# EAGLE design backplane (EAGLE 6.5.0)

## Sheet 1 of 4
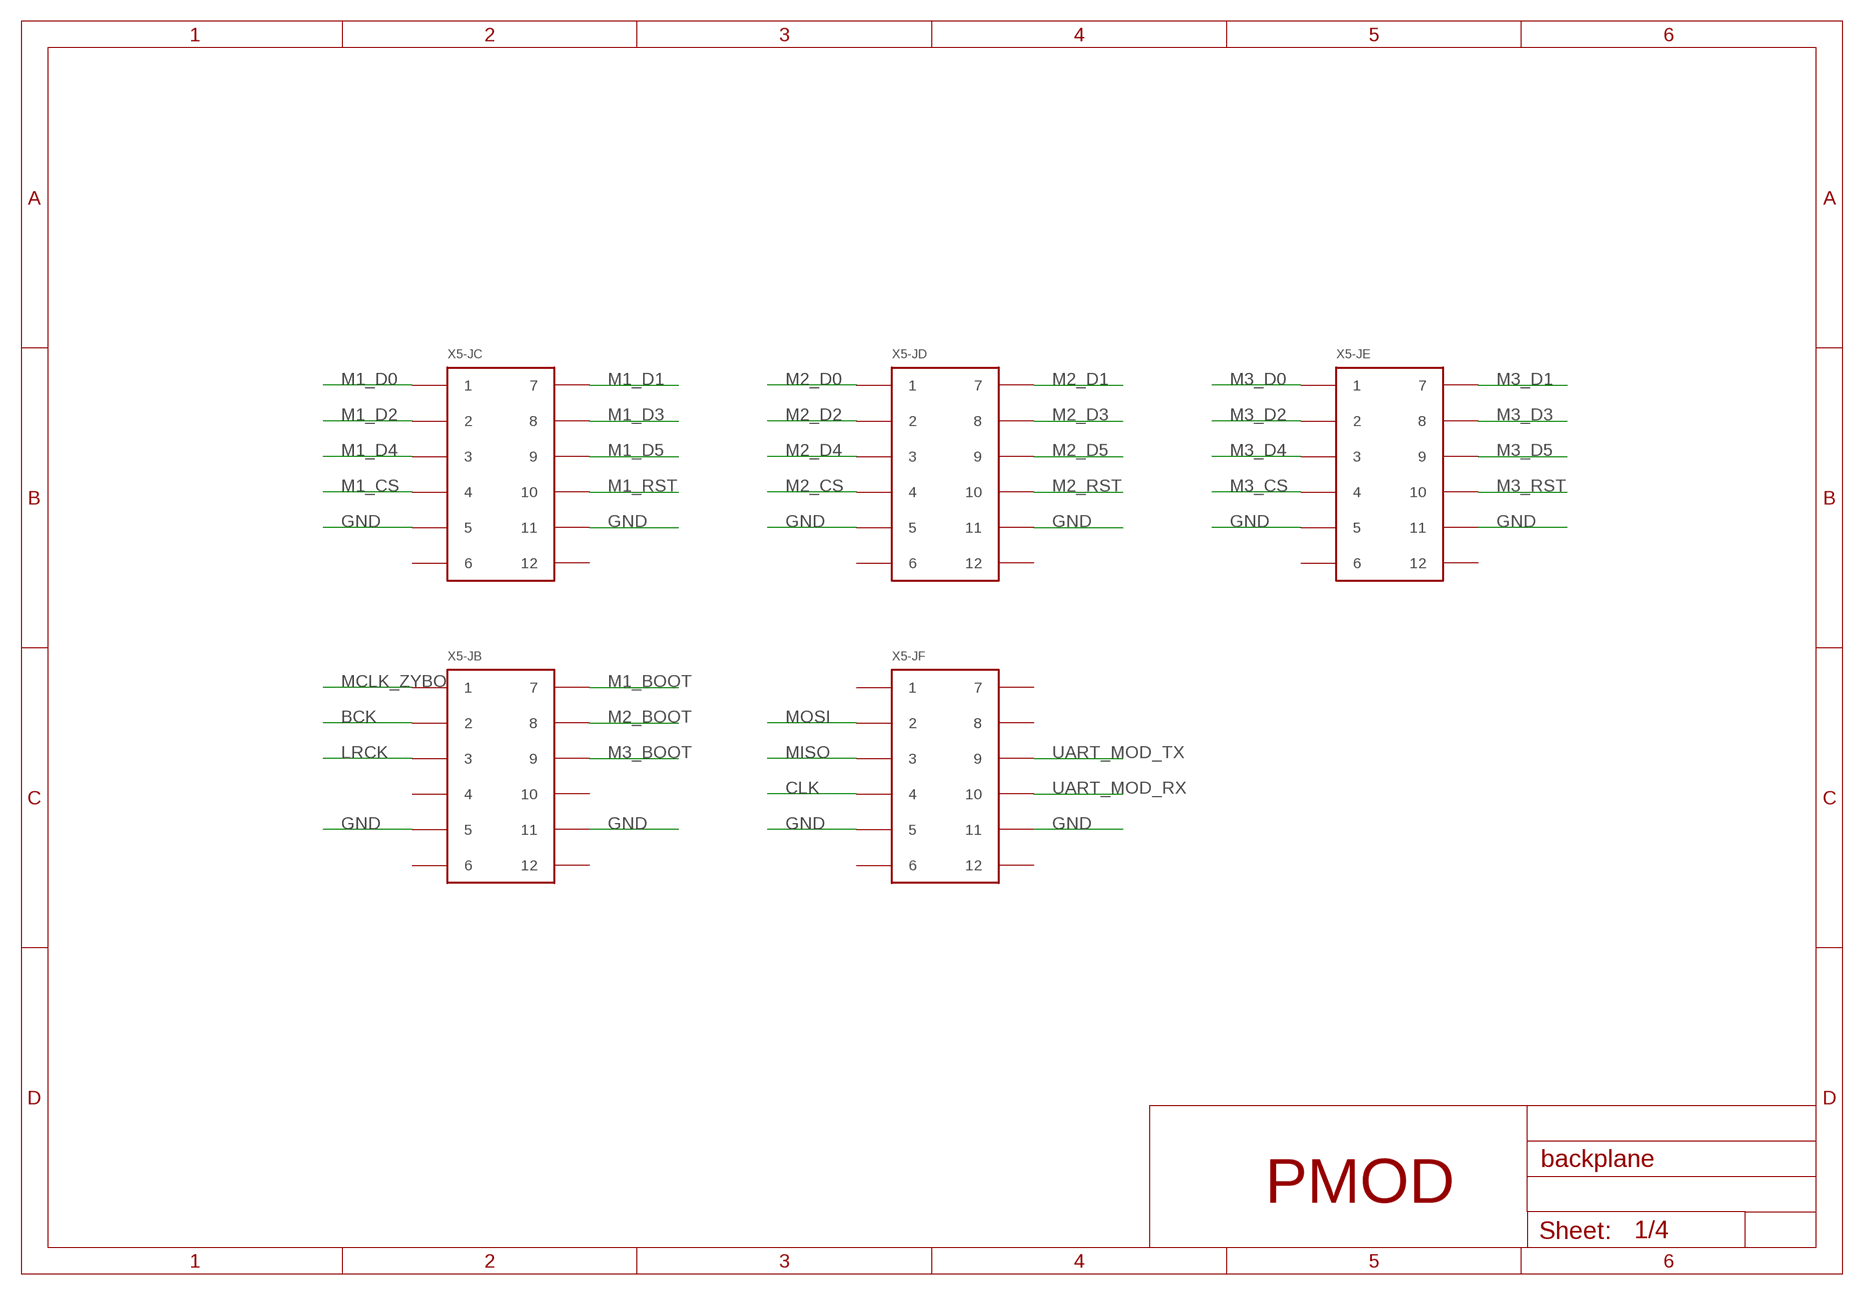
[diagram p0: schematic, sheet 1]
FRAME1 (FRAME): EXCLUDE_FROM_BOM: YES

### Parts
X5-JB  PINCON-2X6  [PINCON-2X6-SMD]
X5-JC  PINCON-2X6  [PINCON-2X6-SMD]
X5-JD  PINCON-2X6  [PINCON-2X6-SMD]
X5-JE  PINCON-2X6  [PINCON-2X6-SMD]
X5-JF  PINCON-2X6  [PINCON-2X6-SMD]

### Nets
BCK: X5-JB.P$2 ; also sheet 2
CLK: X5-JF.P$4 ; also sheet 2
GND: X5-JB.P$5 X5-JB.P$11 X5-JC.P$5 X5-JC.P$11 X5-JD.P$5 X5-JD.P$11 X5-JE.P$5 X5-JE.P$11 X5-JF.P$5 X5-JF.P$11 ; also sheet 2,3,4
LRCK: X5-JB.P$3 ; also sheet 2
M1_BOOT: X5-JB.P$7 ; also sheet 2
M1_CS: X5-JC.P$4 ; also sheet 2
M1_D0: X5-JC.P$1 ; also sheet 2
M1_D1: X5-JC.P$7 ; also sheet 2
M1_D2: X5-JC.P$2 ; also sheet 2
M1_D3: X5-JC.P$8 ; also sheet 2
M1_D4: X5-JC.P$3 ; also sheet 2
M1_D5: X5-JC.P$9 ; also sheet 2
M1_RST: X5-JC.P$10 ; also sheet 2
M2_BOOT: X5-JB.P$8 ; also sheet 2
M2_CS: X5-JD.P$4 ; also sheet 2
M2_D0: X5-JD.P$1 ; also sheet 2
M2_D1: X5-JD.P$7 ; also sheet 2
M2_D2: X5-JD.P$2 ; also sheet 2
M2_D3: X5-JD.P$8 ; also sheet 2
M2_D4: X5-JD.P$3 ; also sheet 2
M2_D5: X5-JD.P$9 ; also sheet 2
M2_RST: X5-JD.P$10 ; also sheet 2
M3_BOOT: X5-JB.P$9 ; also sheet 2
M3_CS: X5-JE.P$4 ; also sheet 2
M3_D0: X5-JE.P$1 ; also sheet 2
M3_D1: X5-JE.P$7 ; also sheet 2
M3_D2: X5-JE.P$2 ; also sheet 2
M3_D3: X5-JE.P$8 ; also sheet 2
M3_D4: X5-JE.P$3 ; also sheet 2
M3_D5: X5-JE.P$9 ; also sheet 2
M3_RST: X5-JE.P$10 ; also sheet 2
MCLK_ZYBO: X5-JB.P$1 ; also sheet 4
MISO: X5-JF.P$3 ; also sheet 2
MOSI: X5-JF.P$2 ; also sheet 2
UART_MOD_RX: X5-JF.P$10 ; also sheet 2
UART_MOD_TX: X5-JF.P$9 ; also sheet 2
Unconnected: X5-JB.P$4 X5-JB.P$6 X5-JB.P$10 X5-JB.P$12 X5-JC.P$6 X5-JC.P$12 X5-JD.P$6 X5-JD.P$12 X5-JE.P$6 X5-JE.P$12 X5-JF.P$1 X5-JF.P$6 X5-JF.P$7 X5-JF.P$8 X5-JF.P$12

### Notes on the sheet
- PMOD

## Sheet 2 of 4
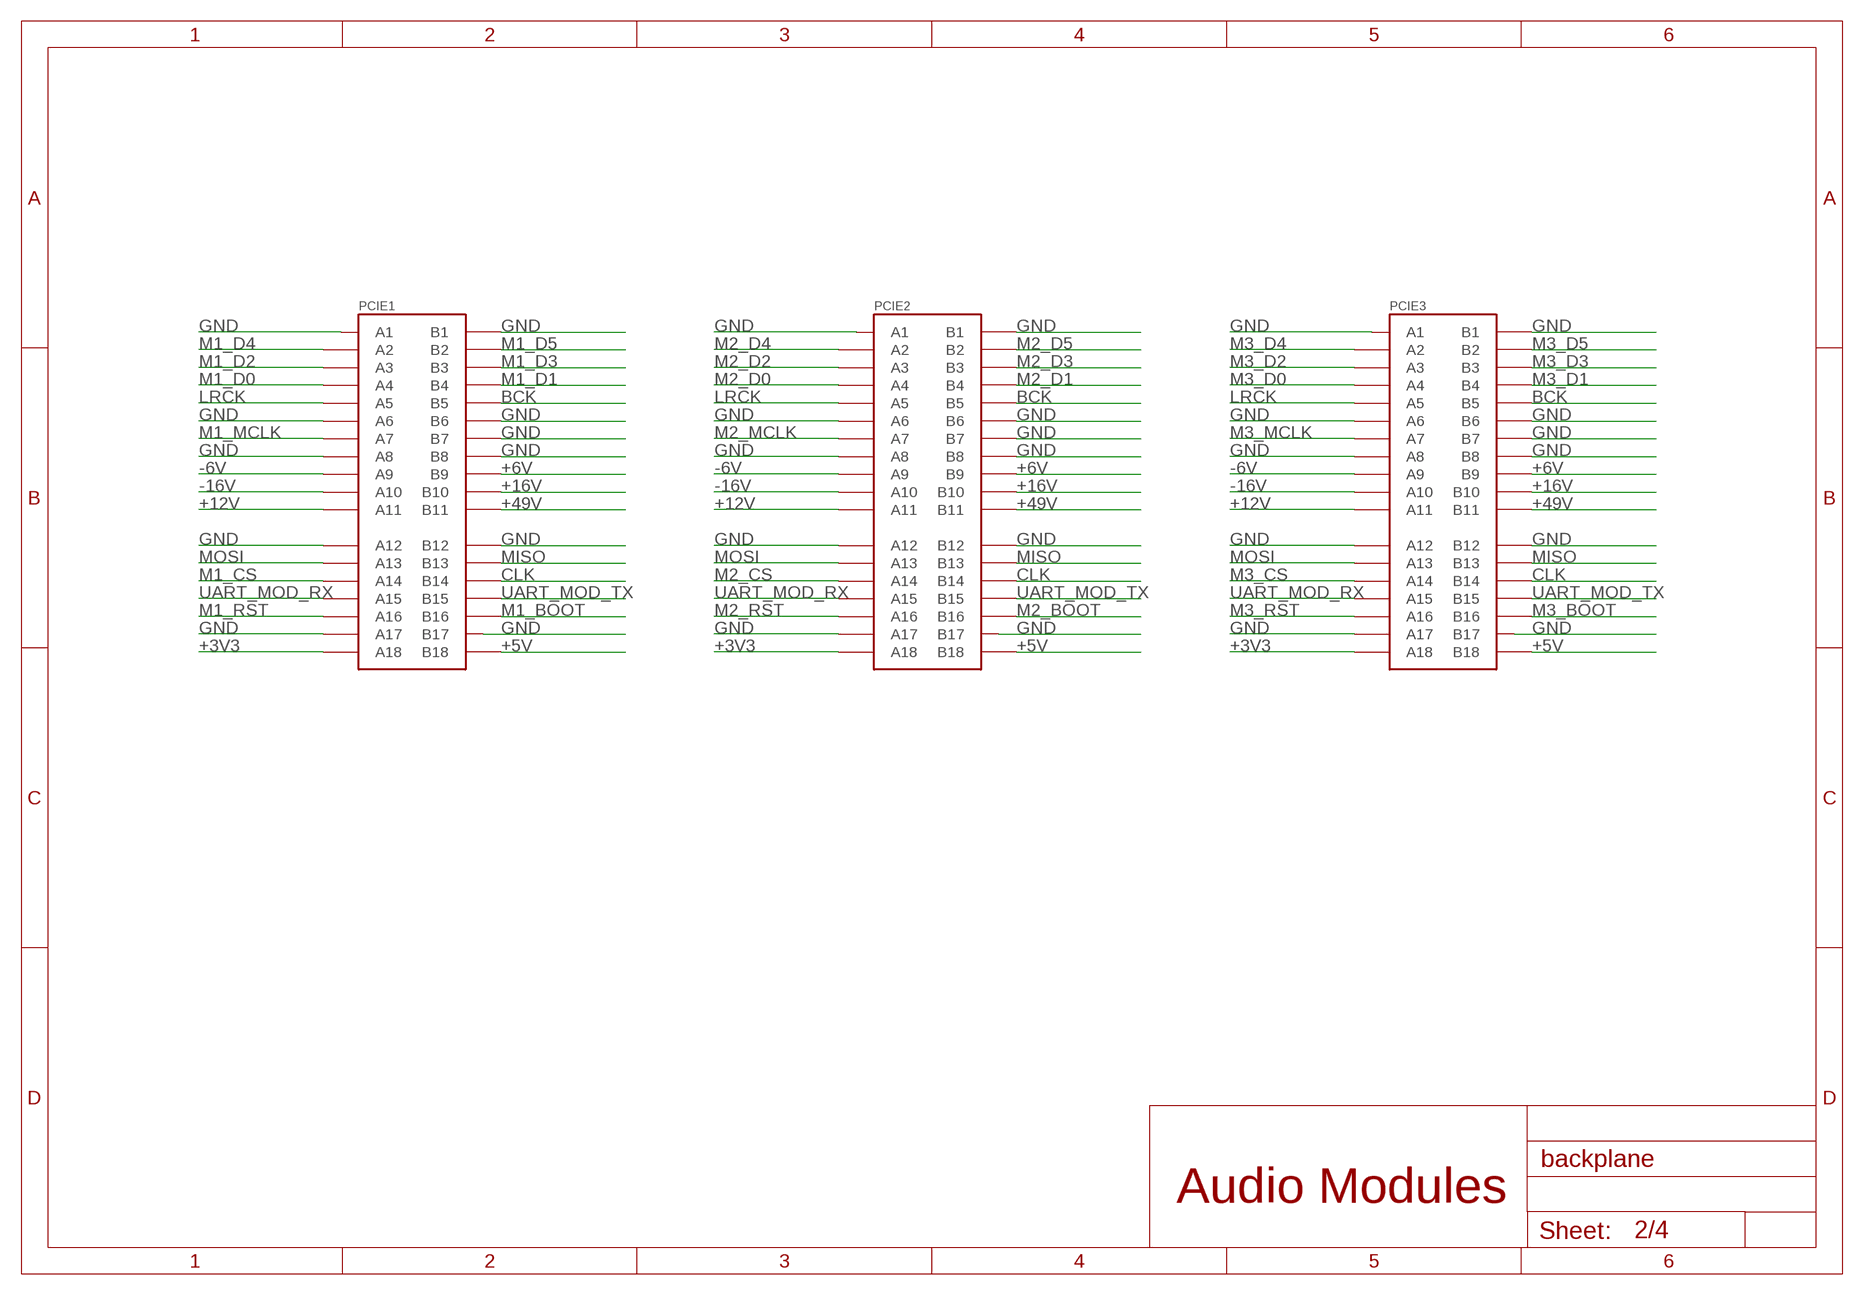
[diagram p1: schematic, sheet 2]
FRAME2 (FRAME): EXCLUDE_FROM_BOM: YES

### Parts
PCIE1  PCIE-36-SKT-SMD  [FCI-10076266-100CLF]
PCIE2  PCIE-36-SKT-SMD  [FCI-10076266-100CLF]
PCIE3  PCIE-36-SKT-SMD  [FCI-10076266-100CLF]

### Nets
+3V3: PCIE1.A18 PCIE2.A18 PCIE3.A18 ; also sheet 3,4
+5V: PCIE1.B19(B18) PCIE2.B19(B18) PCIE3.B19(B18) ; also sheet 3
+6V: PCIE1.B9 PCIE2.B9 PCIE3.B9 ; also sheet 3
+12V: PCIE1.A11 PCIE2.A11 PCIE3.A11 ; also sheet 3
+16V: PCIE1.B10 PCIE2.B10 PCIE3.B10 ; also sheet 3
+49V: PCIE1.B11 PCIE2.B11 PCIE3.B11 ; also sheet 3
-6V: PCIE1.A9 PCIE2.A9 PCIE3.A9 ; also sheet 3
-16V: PCIE1.A10 PCIE2.A10 PCIE3.A10 ; also sheet 3
BCK: PCIE1.B5 PCIE2.B5 PCIE3.B5 ; also sheet 1
CLK: PCIE1.B14 PCIE2.B14 PCIE3.B14 ; also sheet 1
GND: PCIE1.A1 PCIE1.A6 PCIE1.A8 PCIE1.A12 PCIE1.A17 PCIE1.B1 PCIE1.B6 PCIE1.B7 PCIE1.B8 PCIE1.B12 PCIE1.B18(B17) PCIE2.A1 PCIE2.A6 PCIE2.A8 PCIE2.A12 PCIE2.A17 PCIE2.B1 PCIE2.B6 PCIE2.B7 PCIE2.B8 PCIE2.B12 PCIE2.B18(B17) PCIE3.A1 PCIE3.A6 PCIE3.A8 PCIE3.A12 PCIE3.A17 PCIE3.B1 PCIE3.B6 PCIE3.B7 PCIE3.B8 PCIE3.B12 PCIE3.B18(B17) ; also sheet 1,3,4
LRCK: PCIE1.A5 PCIE2.A5 PCIE3.A5 ; also sheet 1
M1_BOOT: PCIE1.B16 ; also sheet 1
M1_CS: PCIE1.A14 ; also sheet 1
M1_D0: PCIE1.A4 ; also sheet 1
M1_D1: PCIE1.B4 ; also sheet 1
M1_D2: PCIE1.A3 ; also sheet 1
M1_D3: PCIE1.B3 ; also sheet 1
M1_D4: PCIE1.A2 ; also sheet 1
M1_D5: PCIE1.B2 ; also sheet 1
M1_MCLK: PCIE1.A7 ; also sheet 4
M1_RST: PCIE1.A16 ; also sheet 1
M2_BOOT: PCIE2.B16 ; also sheet 1
M2_CS: PCIE2.A14 ; also sheet 1
M2_D0: PCIE2.A4 ; also sheet 1
M2_D1: PCIE2.B4 ; also sheet 1
M2_D2: PCIE2.A3 ; also sheet 1
M2_D3: PCIE2.B3 ; also sheet 1
M2_D4: PCIE2.A2 ; also sheet 1
M2_D5: PCIE2.B2 ; also sheet 1
M2_MCLK: PCIE2.A7 ; also sheet 4
M2_RST: PCIE2.A16 ; also sheet 1
M3_BOOT: PCIE3.B16 ; also sheet 1
M3_CS: PCIE3.A14 ; also sheet 1
M3_D0: PCIE3.A4 ; also sheet 1
M3_D1: PCIE3.B4 ; also sheet 1
M3_D2: PCIE3.A3 ; also sheet 1
M3_D3: PCIE3.B3 ; also sheet 1
M3_D4: PCIE3.A2 ; also sheet 1
M3_D5: PCIE3.B2 ; also sheet 1
M3_MCLK: PCIE3.A7 ; also sheet 4
M3_RST: PCIE3.A16 ; also sheet 1
MISO: PCIE1.B13 PCIE2.B13 PCIE3.B13 ; also sheet 1
MOSI: PCIE1.A13 PCIE2.A13 PCIE3.A13 ; also sheet 1
UART_MOD_RX: PCIE1.A15 PCIE2.A15 PCIE3.A15 ; also sheet 1
UART_MOD_TX: PCIE1.B15 PCIE2.B15 PCIE3.B15 ; also sheet 1

### Notes on the sheet
- Audio Modules

## Sheet 3 of 4
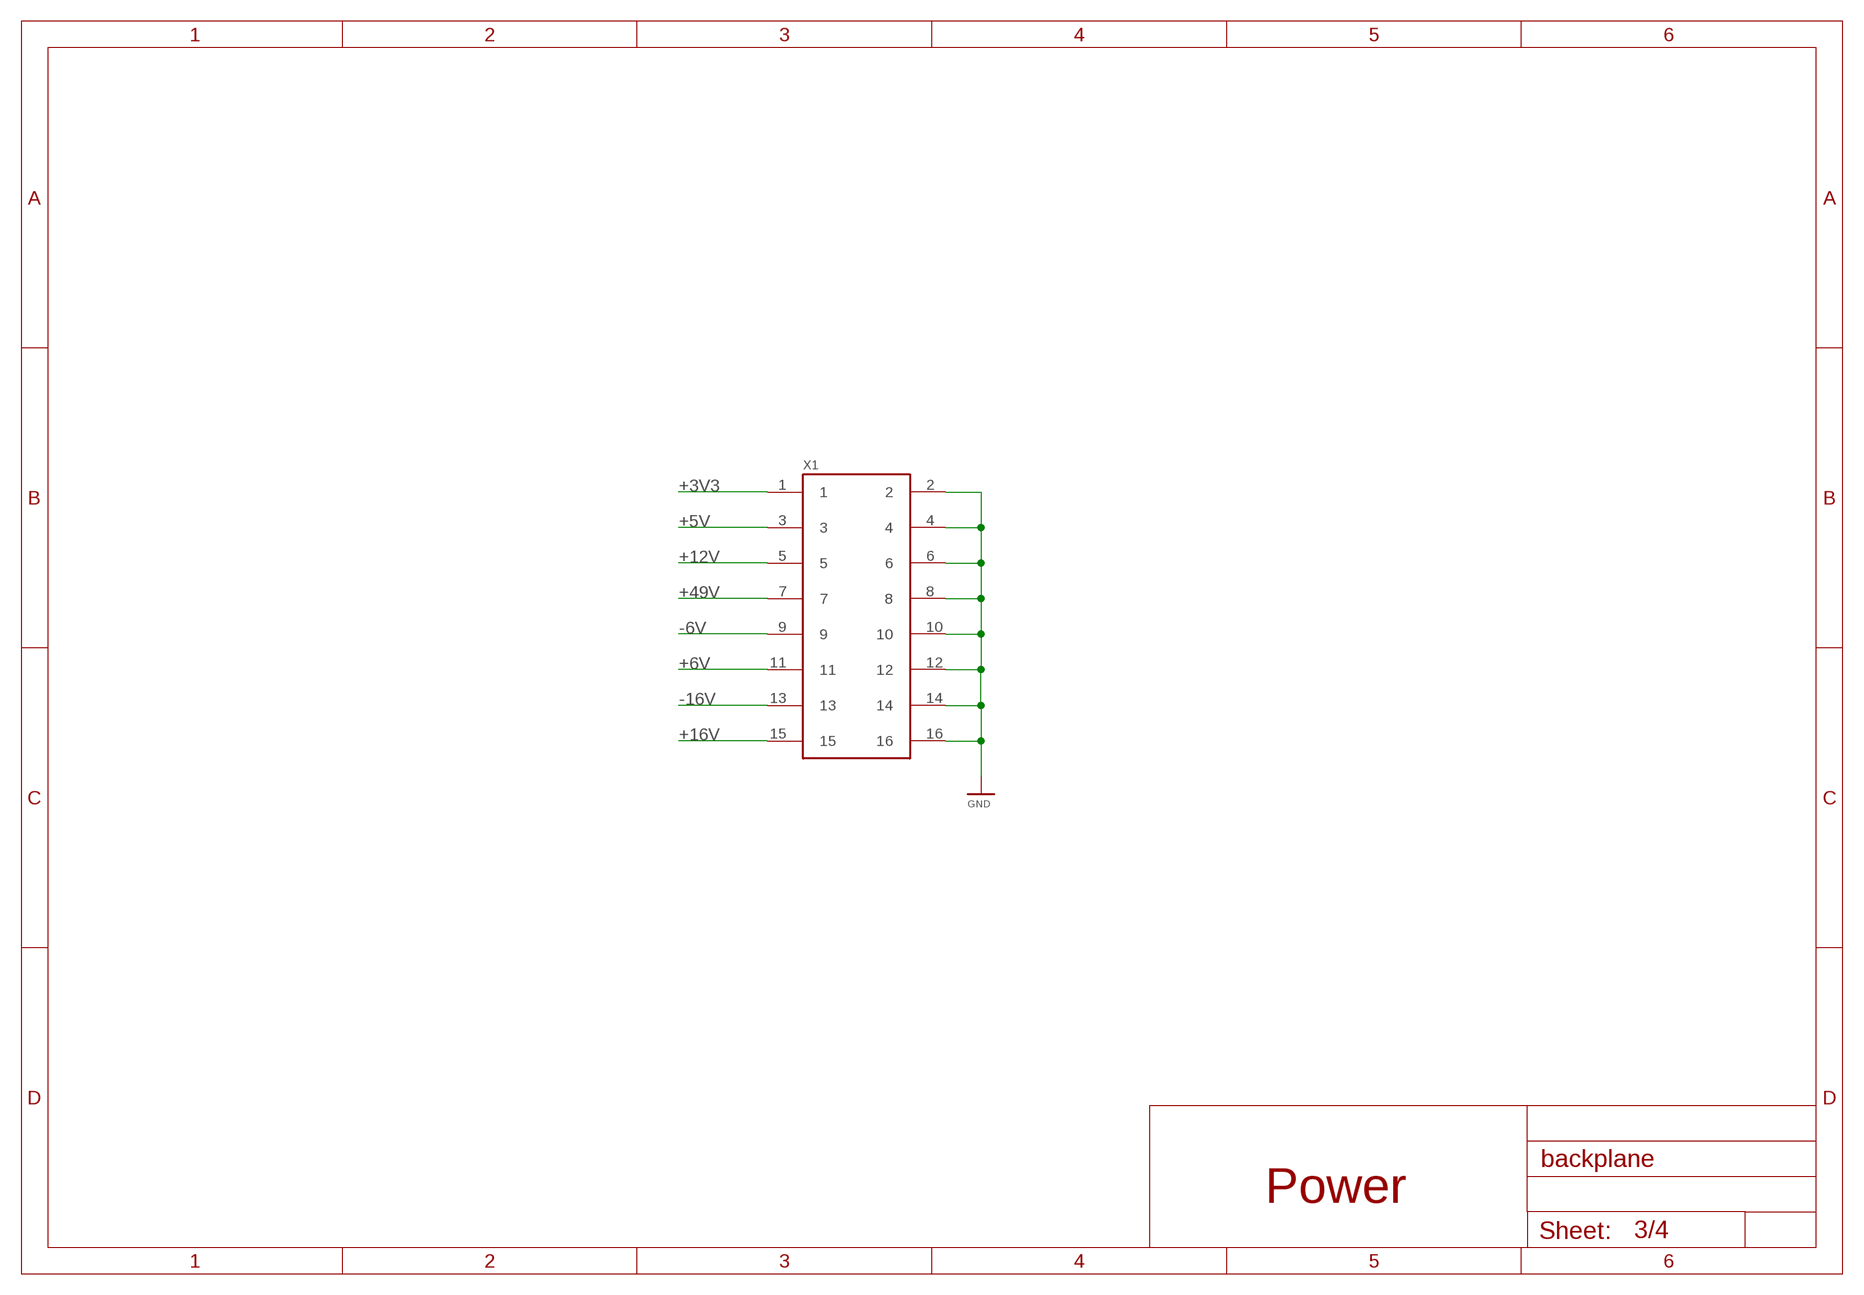
[diagram p2: schematic, sheet 3]
FRAME3 (FRAME): EXCLUDE_FROM_BOM: YES

### Parts
X1  PINCON-2X8  [PINCON-2X8]

### Nets
+3V3: X1.1 ; also sheet 2,4
+5V: X1.3 ; also sheet 2
+6V: X1.11 ; also sheet 2
+12V: X1.5 ; also sheet 2
+16V: X1.15 ; also sheet 2
+49V: X1.7 ; also sheet 2
-6V: X1.9 ; also sheet 2
-16V: X1.13 ; also sheet 2
GND: X1.2 X1.4 X1.6 X1.8 X1.10 X1.12 X1.14 X1.16 ; also sheet 1,2,4

### Notes on the sheet
- Power

## Sheet 4 of 4
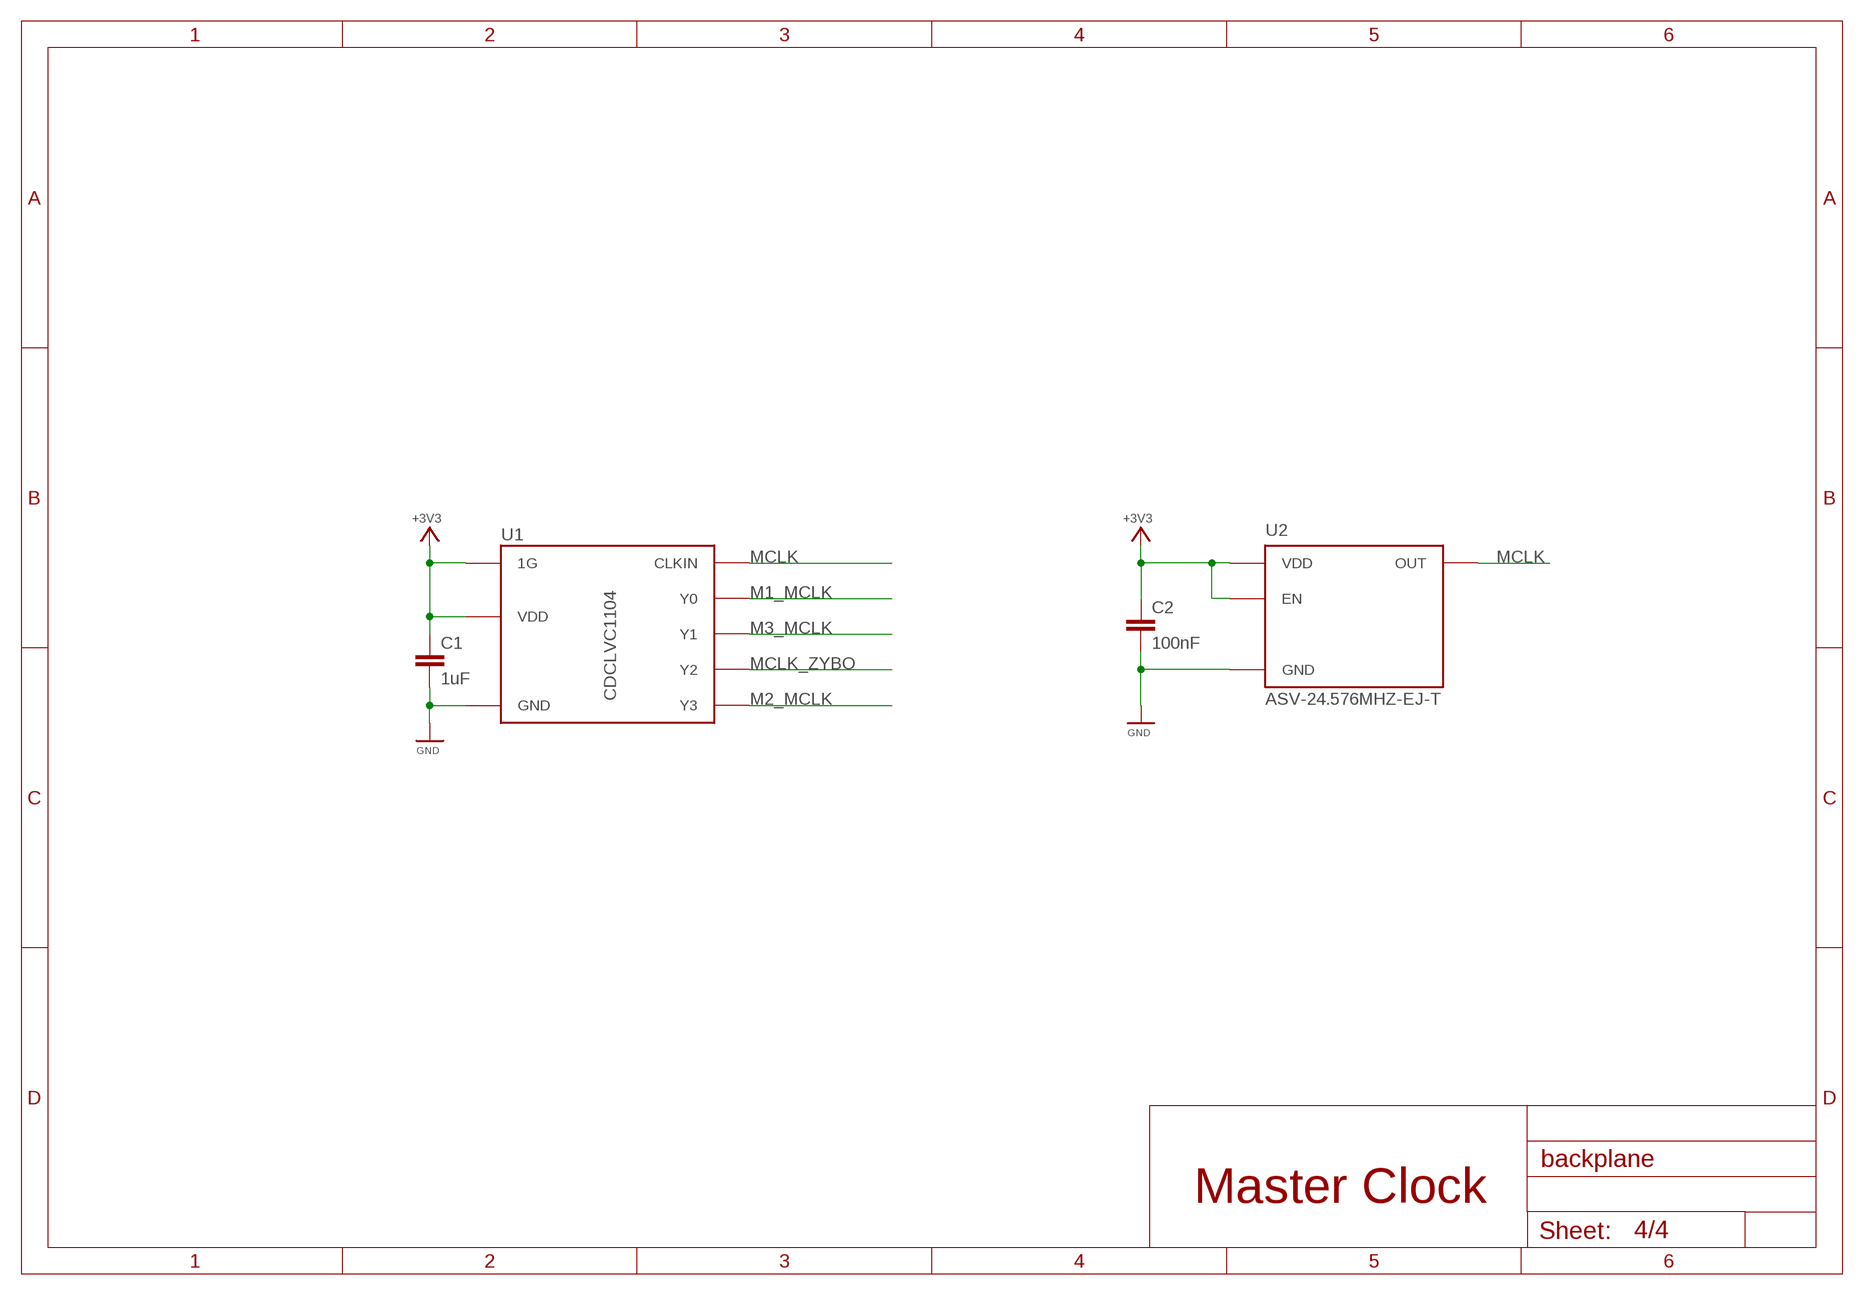
[diagram p3: schematic, sheet 4]
FRAME4 (FRAME): EXCLUDE_FROM_BOM: YES

### Parts
C1  1uF  C0805  [C0805]
C2  100nF  C0603  [C0603]
U1  CDCLVC1104  [TSSOP8]
U2  ASV-24.576MHZ-EJ-T  ABRACON_ASV  [ABRACON_ASV]

### Nets
+3V3: C1.1 C2.1 U1.2(1G) U1.6(VDD) U2.1(EN) U2.4(VDD) ; also sheet 2,3
GND: C1.2 C2.2 U1.4(GND) U2.2(GND) ; also sheet 1,2,3
M1_MCLK: U1.3(Y0) ; also sheet 2
M2_MCLK: U1.7(Y3) ; also sheet 2
M3_MCLK: U1.8(Y1) ; also sheet 2
MCLK: U1.1(CLKIN) U2.3(OUT)
MCLK_ZYBO: U1.5(Y2) ; also sheet 1

### Notes on the sheet
- Master Clock

## Library data of the parts
C1 C2 = plr_rcl:C
PCIE1-PCIE3 = plc_con:PCIE-36-*: PCI-E 36-way connectors; MANUFACTURER: FCI; MPN: 10061913-100CLF; OC_DIGIKEY: 609-2882-ND; OC_MOUSER: 649-10061913-100CLF
U1 = plr_ic:CDCLVC1104; MANUFACTURER: TI; MPN: CDCLVC1104PW; OC_DIGIKEY: 296-27549-1-ND; OC_FARNELL: 1829681; OC_MOUSER: 595-CDCLVC1104PW
U2 = plr_crystal:ABRACON_ASV; MANUFACTURER: ABRACON; MPN: ASV-24.576MHZ-EJ-T; OC_DIGIKEY: 535-9318-1-ND; OC_FARNELL: 1611834; OC_MOUSER: 815-ASV-24.576-EJ-T
X1 = plc_con:PINCON-2X8
X5-JB X5-JC X5-JD X5-JE X5-JF = plc_con:PINCON-2X6

## Board
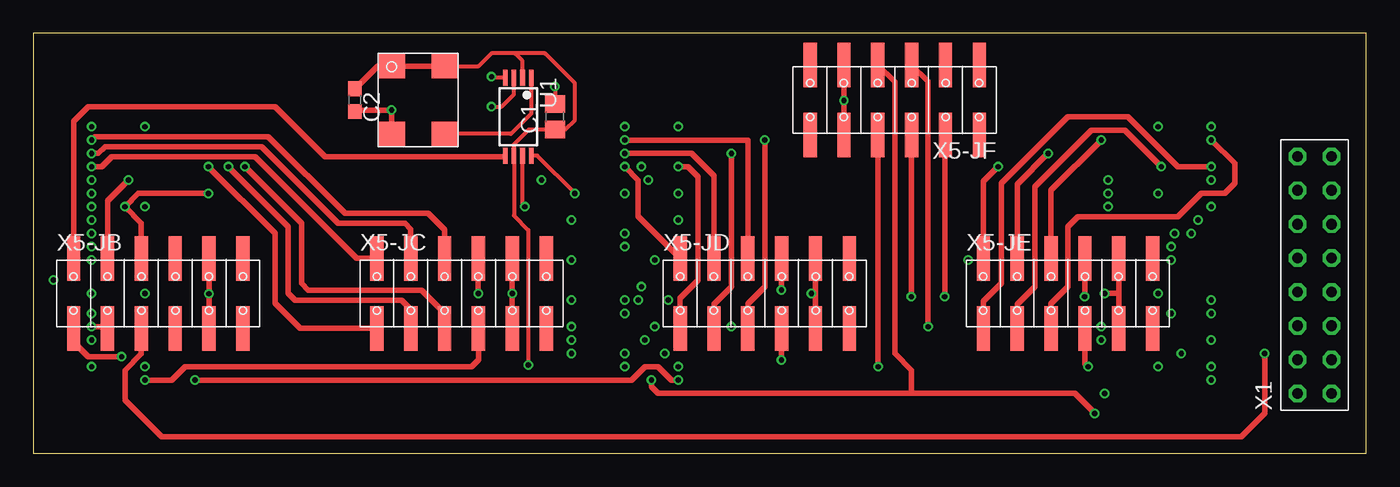
[diagram p4: board, top side]
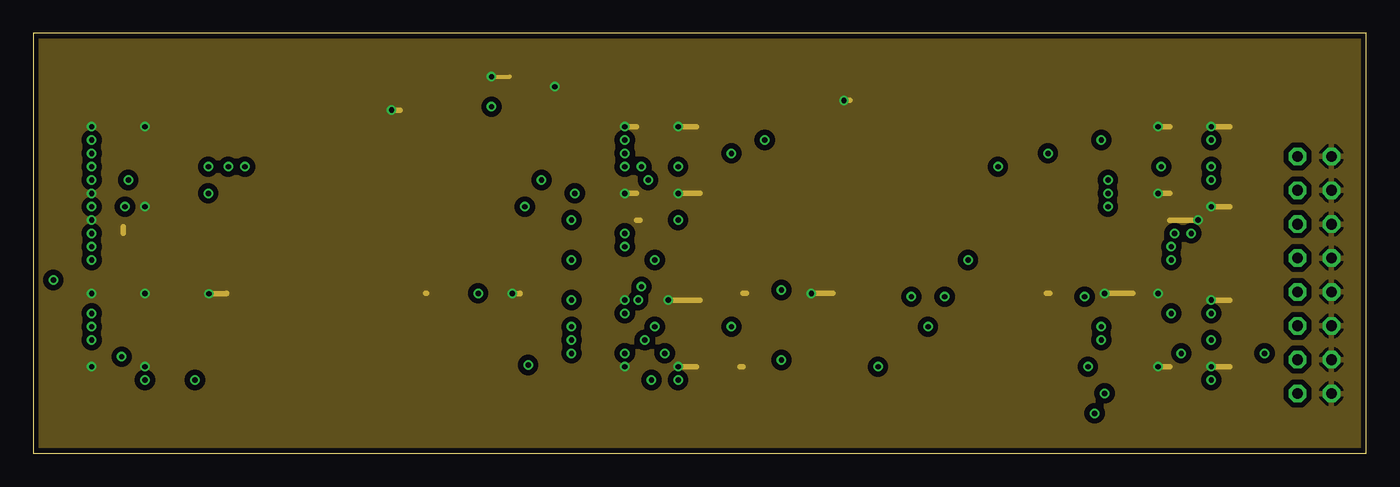
[diagram p5: board, inner layer GND]
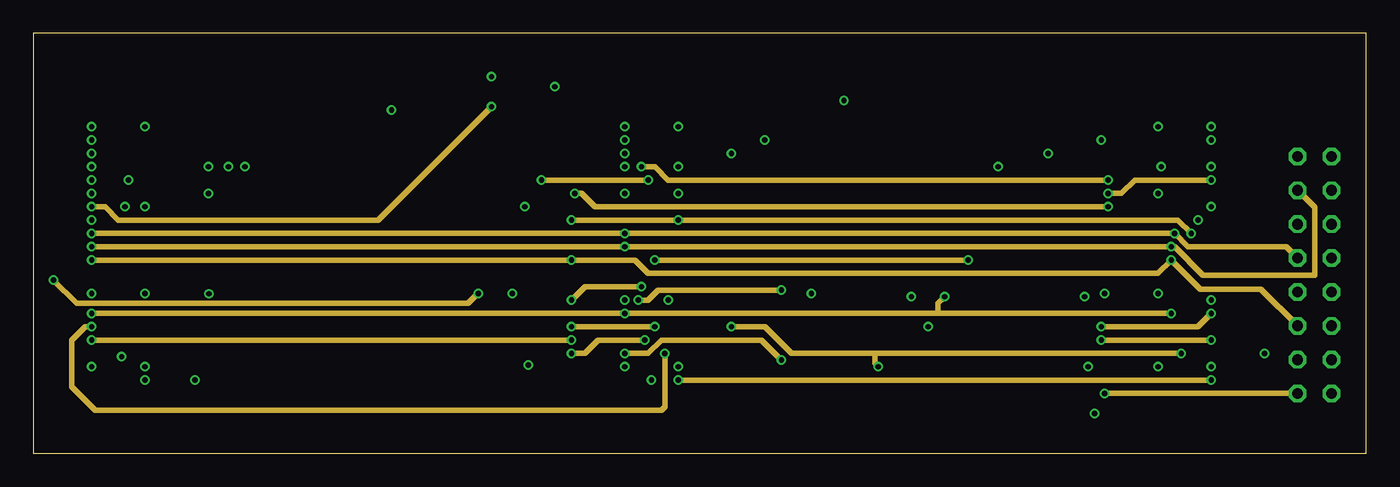
[diagram p6: board, inner layer Route15]
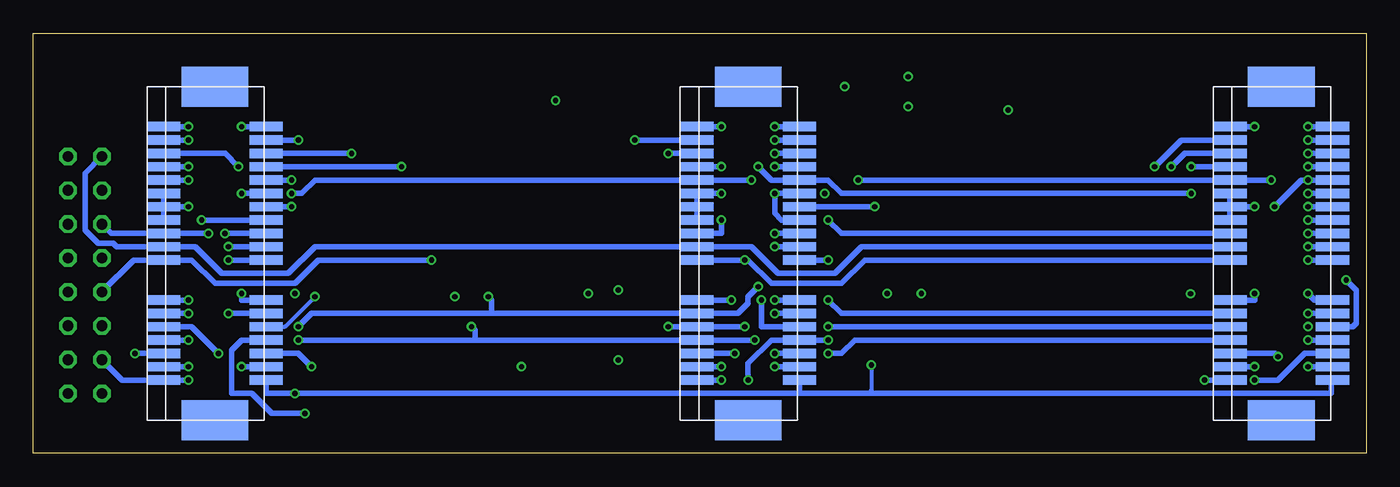
[diagram p7: board, bottom side, seen from below]

Size 100 x 31.5 mm. Coordinates in mm from the lower left corner, seen from the top.
Outline: 0,0 100,0 100,31.5 0,31.5 0,0
Copper layers ((1*2)+(15*16)): Top 0.035mm / dielectric 0.2mm / GND 0.035mm / dielectric 1mm / Route15 0.035mm / dielectric 0.2mm / Bottom 0.035mm
Design rules "Fusion_eagle_rule_v1.1 *": minimum track width 6mil, minimum drill 12mil, track to track 6mil, track to pad 6mil, pad to pad 6mil, via to via 6mil, smd to smd 0mil, copper to edge 10mil, drill to drill 10mil, minimum pad ring 10mil, minimum via ring 6mil, stop-mask expansion 2mil, vias tented up to drill 100mil, thermal gap 10mil

### Footprints (pad centres in the part's own frame; a part is rotated, then mirrored left to right if it is on the bottom)
C0805 = smd 1.3 x 1.5: 1 -0.95,0; 2 0.95,0
C0603 = smd 1.1 x 1: 1 -0.85,0; 2 0.85,0
FCI-10076266-100CLF = smd 0.7 x 2.5: A1 -9.5,3.85; A2 -8.5,3.85; A3 -7.5,3.85; A4 -6.5,3.85; A5 -5.5,3.85; A6 -4.5,3.85; A7 -3.5,3.85; A8 -2.5,3.85; A9 -1.5,3.85; A10 -0.5,3.85; A11 0.5,3.85; A12 3.5,3.85; A13 4.5,3.85; A14 5.5,3.85; A15 6.5,3.85; A16 7.5,3.85; A17 8.5,3.85; A18 9.5,3.85; B1 -9.5,-3.85; B2 -8.5,-3.85; B3 -7.5,-3.85; B4 -6.5,-3.85; B5 -5.5,-3.85; B6 -4.5,-3.85; B7 -3.5,-3.85; B8 -2.5,-3.85; B9 -1.5,-3.85; B10 -0.5,-3.85; B11 0.5,-3.85; B12 3.5,-3.85; B13 4.5,-3.85; B14 5.5,-3.85; B15 6.5,-3.85; B16 7.5,-3.85; B18 8.5,-3.85; B19 9.5,-3.85 | smd 3 x 5: P$37 -12.5,0; P$38 12.5,0
TSSOP8 = smd 1.2 x 0.35: 1 -2.925,0.975; 2 -2.925,0.325; 3 -2.925,-0.325; 4 -2.925,-0.975; 5 2.925,-0.975; 6 2.925,-0.325; 7 2.925,0.325; 8 2.925,0.975
ABRACON_ASV = smd 1.8 x 2: 1 -2.54,-2; 2 2.54,-2; 3 2.54,2; 4 -2.54,2
PINCON-2X8 = drill 0.8 octagon: 1 -8.89,1.27; 2 -8.89,-1.27; 3 -6.35,1.27; 4 -6.35,-1.27; 5 -3.81,1.27; 6 -3.81,-1.27; 7 -1.27,1.27; 8 -1.27,-1.27; 9 1.27,1.27; 10 1.27,-1.27; 11 3.81,1.27; 12 3.81,-1.27; 13 6.35,1.27; 14 6.35,-1.27; 15 8.89,1.27; 16 8.89,-1.27
PINCON-2X6-SMD = smd 1 x 3.35: P$1 -6.35,2.625; P$2 -3.81,2.625; P$3 -1.27,2.625; P$4 1.27,2.625; P$5 3.81,2.625; P$6 6.35,2.625; P$7 -6.35,-2.625; P$8 -3.81,-2.625; P$9 -1.27,-2.625; P$10 1.27,-2.625; P$11 3.81,-2.625; P$12 6.35,-2.625

### Placement (x,y rotation side)
C1  39.12,25.25 90 top
C2  24.12,26.5 270 top
PCIE1  6.38,15 270 bottom
PCIE2  46.38,15 270 bottom
PCIE3  86.38,15 270 bottom
U1  36.38,25.25 270 top
U2  28.88,26.5 270 top
X1  96.12,13.38 90 top
X5-JB  9.38,12 0 top
X5-JC  32.12,12 0 top
X5-JD  54.88,12 0 top
X5-JE  77.62,12 0 top
X5-JF  64.62,26.5 180 top

### Tracks (layer width: path | path; a pad name or v marks a point on that pad's centre or on a via)
+3V3  (via drill 0.4)
  Top 0.3: U2.4 33.41,29.04 34.38,30 36.12,30 | U1.2 36.7,29.43 36.12,30 | 36.12,30 38.38,30 40.62,27.75 40.62,25 39.92,24.3 C1.1 37.17,24.3 36.05,23.18 U1.6 36.05,17.82 37.12,16.75 v37.12,6.62
  Top 0.406: C2.1 25.82,29.04 U2.1 U2.4
  Route15 0.406: v80.38,4.5 94.84,4.5 X1.1
  Bottom 0.3: v37.12,6.62 37.12,4.75 37.38,4.5
  Bottom 0.406: PCIE1.A18 2.62,5.5 2.62,4.5 37.38,4.5 42.52,4.5 | PCIE2.A18 42.52,4.5 | 42.52,4.5 v80.38,4.5 82.53,4.5 PCIE3.A18
+5V  (via drill 0.4)
  Top 0.406: v12.12,5.5 44.88,5.5 45.88,6.5 46.88,6.5 47.88,5.5 v48.38,5.5
  Route15 0.406: v48.38,5.5 v88.38,5.5
  Bottom 0.406: PCIE1.B19 v12.12,5.5 | v48.38,5.5 PCIE2.B19 | v88.38,5.5 PCIE3.B19 93.33,5.5 X1.3
+6V  (via drill 0.4)
  Route15 0.406: v40.38,17.5 v48.38,17.5 85.88,17.5 v86.88,16.5
  Bottom 0.406: PCIE1.B9 39.38,16.5 v40.38,17.5 | v48.38,17.5 48.38,16.5 PCIE2.B9 | v86.88,16.5 PCIE3.B9 94.17,16.5 X1.11
+12V  (via drill 0.4)
  Route15 0.406: v4.38,14.5 v40.38,14.5 45.12,14.5 46.12,13.5 84.38,13.5 v85.38,14.5 87.56,12.31 92.11,12.31 X1.5
  Bottom 0.406: v4.38,14.5 PCIE1.A11 | v85.38,14.5 PCIE3.A11 | v40.38,14.5 PCIE2.A11
+16V
  Bottom 0.406: PCIE1.B10 37.88,15.5 39.88,13.5 44.12,13.5 46.12,15.5 PCIE2.B10 78.88,15.5 80.88,13.5 85.88,13.5 87.88,15.5 PCIE3.B10 93.75,15.5 94,15.75 95.12,15.75 96.12,16.75 96.12,21 X1.15
+49V  (via drill 0.4)
  Route15 0.406: v46.62,14.5 v70.12,14.5
  Bottom 0.406: PCIE1.B11 37.62,14.5 39.38,12.75 44.62,12.75 46.38,14.5 v46.62,14.5 PCIE2.B11 | v70.12,14.5 78.62,14.5 80.38,12.75 86.38,12.75 88.12,14.5 PCIE3.B11 92.46,14.5 X1.7
-6V  (via drill 0.4)
  Route15 0.406: v4.38,16.5 v44.38,16.5 v85.62,16.5 86.62,15.5 94,15.5 X1.9
  Bottom 0.406: PCIE1.A9 v4.38,16.5 | v44.38,16.5 PCIE2.A9 | v85.62,16.5 PCIE3.A9
-16V  (via drill 0.4)
  Route15 0.406: v4.38,15.5 v44.38,15.5 v85.38,15.5 85.62,15.5 87.75,13.38 96.12,13.38 96.12,18.45 X1.13
  Bottom 0.406: PCIE1.A10 v4.38,15.5 | v44.38,15.5 PCIE2.A10 | v85.38,15.5 PCIE3.A10
BCK  (via drill 0.4)
  Top 0.406: X5-JB.P$2 5.57,18.94 v7.12,20.5
  Route15 0.406: v38.12,20.5 v46.12,20.5 | v80.62,19.5 81.62,19.5 82.62,20.5 v88.38,20.5
  Bottom 0.406: v7.12,20.5 PCIE1.B5 v38.12,20.5 | v46.12,20.5 PCIE2.B5 78.88,20.5 79.88,19.5 v80.62,19.5 | v88.38,20.5 PCIE3.B5
CLK  (via drill 0.4)
  Top 0.406: X5-JF.P$4 63.38,23.86 v63.38,6.5
  Route15 0.406: v40.38,9.5 v46.62,9.5 | v86.12,7.5 63.12,7.5 | 63.12,7.5 56.88,7.5 54.88,9.5 v52.38,9.5 | v63.38,6.5 63.12,6.75 63.12,7.5
  Bottom 0.406: PCIE1.B14 v40.38,9.5 | v46.62,9.5 PCIE2.B14 v52.38,9.5 | PCIE3.B14 88.12,9.5 v86.12,7.5
GND  (via drill 0.4)
  Top 0.3: 39.17,26.25 39.17,27.45 v39.12,27.5 | U1.4 34.45,28.18 v34.38,28.25
  Top 0.406: X5-JB.P$5 v13.19,11.97 X5-JB.P$11 | X5-JC.P$11 v35.94,11.98 X5-JC.P$5 | X5-JD.P$11 58.69,11.96 | 58.69,11.96 X5-JD.P$5 | 58.69,11.96 58.41,11.96 v58.38,12 | X5-JE.P$11 81.44,12.01 | 81.44,12.01 X5-JE.P$5 | 81.44,12.01 v80.38,12.01 v80.38,12 | X5-JF.P$5 v60.81,26.47 X5-JF.P$11 | C2.2 24.23,25.75 v26.88,25.75 U2.2 | C1.2 39.17,26.25
  GND 0.3: v34.38,28.25 35.75,28.25
  GND 0.406: 6.75,17 6.75,16.5 | v44.38,24.5 45.25,24.5 | v48.38,24.5 49.75,24.5 | v44.38,19.5 45.25,19.5 | 45.5,17.5 45.25,17.5 | v48.38,6.5 49.75,6.5 | 53.25,6.5 53,6.5 | 29.44,12 29.5,12 | 53.5,12 53.25,12 | 76.25,12 76,12 | v84.38,6.5 85.25,6.5 | v88.38,6.5 89.75,6.5 | v88.38,11.5 89.75,11.5 | v87.38,17.5 85.25,17.5 | v84.38,19.5 85.25,19.5 | v88.38,18.5 89.75,18.5 | v84.38,24.5 85.25,24.5 | v88.38,24.5 89.75,24.5 | v13.19,11.97 14.47,11.97 14.5,12 | v47.62,11.5 50,11.5 | v35.94,11.98 36.52,11.98 36.5,12 | v58.38,12 60,12 | v80.38,12 82.5,12 | v48.38,19.5 50,19.5 | v60.81,26.47 61.28,26.47 61.25,26.5 | v26.88,25.75 27.5,25.75
  Bottom 0.406: PCIE1.A1 v4.38,24.5 | PCIE1.B1 v8.38,24.5 | PCIE1.A6 v4.38,19.5 | PCIE1.A8 v4.38,17.5 | PCIE1.B6 PCIE1.B7 | PCIE1.B7 PCIE1.B8 | PCIE1.B7 v8.38,18.5 | PCIE1.A17 v4.38,6.5 | PCIE1.B12 8.38,11.5 v8.38,12 | PCIE2.A1 v44.38,24.5 | PCIE2.B1 v48.38,24.5 | PCIE2.A6 v44.38,19.5 44.38,18 43.88,17.5 PCIE2.A8 | PCIE2.B8 PCIE2.B7 PCIE2.B6 v48.38,19.5 | PCIE2.A12 v44.38,11.5 | PCIE2.A17 v44.38,6.5 | PCIE2.B18 v48.38,6.5 | PCIE3.A17 v84.38,6.5 | PCIE3.B18 v88.38,6.5 | PCIE3.A12 84.38,11.5 v84.38,12 | PCIE3.B12 v88.38,11.5 | PCIE3.A8 v87.38,17.5 | PCIE3.A6 v84.38,19.5 | PCIE3.B8 PCIE3.B7 | PCIE3.B7 PCIE3.B6 | PCIE3.B7 v88.38,18.5 | PCIE3.A1 v84.38,24.5 | PCIE3.B1 v88.38,24.5 | PCIE2.B12 v47.62,11.5 | PCIE1.B18 v8.38,6.5 | PCIE1.A12 3.88,11.5 v4.38,12
  pour GND (isolate 0.4): -3.5,35 105.5,35 105.5,-2.75 -3.5,-2.75
LRCK  (via drill 0.4)
  Top 0.406: X5-JB.P$3 8.11,17.27 v6.88,18.5 7.88,19.5 v13.12,19.5
  Route15 0.406: v45.62,21.5 46.62,21.5 47.62,20.5 v80.62,20.5
  Bottom 0.406: v6.88,18.5 4.88,20.5 v4.38,20.5 PCIE1.A5 | v13.12,19.5 39.38,19.5 40.38,20.5 PCIE2.A5 44.62,20.5 v45.62,21.5 | v80.62,20.5 PCIE3.A5
M1_BOOT  (via drill 0.4)
  Top 0.406: v6.62,7.25 4.12,7.25 3.02,8.35 X5-JB.P$7
  Bottom 0.406: PCIE1.B16 6.88,7.5 v6.62,7.25
M1_CS  (via drill 0.4)
  Top 0.406: v33.38,12 33.38,14.61 X5-JC.P$4
  Route15 0.406: v1.5,13 3.25,11.25 32.62,11.25 v33.38,12
  Bottom 0.406: PCIE1.A14 1,9.5 0.75,9.75 0.75,12.25 v1.5,13
M1_D0  (via drill 0.4)
  Top 0.406: X5-JC.P$1 24.25,14.62 16.62,22.25 5.88,22.25 5.12,21.5 v4.38,21.5
  Bottom 0.406: v4.38,21.5 PCIE1.A4
M1_D1  (via drill 0.4)
  Top 0.406: X5-JC.P$7 20,9.38 18.12,11.25 18.12,16.5 v13.12,21.5
  Bottom 0.406: v13.12,21.5 PCIE1.B4
M1_D2  (via drill 0.4)
  Top 0.406: X5-JC.P$2 28.32,16.81 27.88,17.25 22.88,17.25 17.12,23 5.38,23 4.88,22.5 v4.38,22.5
  Bottom 0.406: v4.38,22.5 PCIE1.A3
M1_D3  (via drill 0.4)
  Top 0.406: X5-JC.P$8 28.32,10.81 27.62,11.5 19.62,11.5 19.12,12 19.12,17 v14.62,21.5
  Bottom 0.406: v14.62,21.5 13.62,22.5 PCIE1.B3
M1_D4  (via drill 0.4)
  Top 0.406: X5-JC.P$3 30.86,16.77 29.62,18 23.38,18 17.62,23.75 4.62,23.75 v4.38,23.5
  Bottom 0.406: v4.38,23.5 PCIE1.A2
M1_D5  (via drill 0.4)
  Top 0.406: X5-JC.P$9 30.86,10.52 29.12,12.25 20.62,12.25 20.12,12.75 20.12,17.25 v15.88,21.5
  Bottom 0.406: v15.88,21.5 13.88,23.5 PCIE1.B2
M1_MCLK  (via drill 0.4)
  Top 0.3: v34.38,26 35.12,26 36.05,26.93 U1.3
  Route15 0.406: v4.38,18.5 5.38,18.5 6.38,17.5 25.88,17.5 v34.38,26
  Bottom 0.406: PCIE1.A7 v4.38,18.5
M1_RST  (via drill 0.4)
  Top 0.406: v8.38,5.5 10.38,5.5 11.38,6.5 32.88,6.5 33.4,7.02 X5-JC.P$10
  Bottom 0.406: PCIE1.A16 4.62,7.5 6.62,5.5 v8.38,5.5
M2_BOOT  (via drill 0.4)
  Top 0.406: v4.38,9.5 5.44,9.5 X5-JB.P$8
  Route15 0.406: v47.38,7.5 47.38,3.5 47.12,3.25 4.62,3.25 2.88,5 2.88,8.5 3.88,9.5 v4.38,9.5
  Bottom 0.406: PCIE2.B16 v47.38,7.5
M2_CS  (via drill 0.4)
  Top 0.406: v56.12,12.25 56.12,14.61 X5-JD.P$4
  Route15 0.406: v45.38,11.5 46.12,11.5 46.88,12.25 v56.12,12.25
  Bottom 0.406: PCIE2.A14 45.38,9.5 v45.38,11.5
M2_D0  (via drill 0.4)
  Top 0.406: X5-JD.P$1 45.38,17.77 45.38,20.5 v44.38,21.5
  Bottom 0.406: v44.38,21.5 PCIE2.A4
M2_D1  (via drill 0.4)
  Top 0.406: X5-JD.P$7 48.52,11.65 49.88,13 49.88,20.75 49.12,21.5 v48.38,21.5
  Bottom 0.406: v48.38,21.5 PCIE2.B4
M2_D2  (via drill 0.4)
  Top 0.406: X5-JD.P$2 51.06,20.81 49.38,22.5 v44.38,22.5
  Bottom 0.406: v44.38,22.5 PCIE2.A3
M2_D3  (via drill 0.4)
  Top 0.406: X5-JD.P$8 51.06,11.19 52.38,12.5 v52.38,22.5
  Bottom 0.406: v52.38,22.5 PCIE2.B3
M2_D4  (via drill 0.4)
  Top 0.406: X5-JD.P$3 53.6,23.5 v44.38,23.5
  Bottom 0.406: v44.38,23.5 PCIE2.A2
M2_D5  (via drill 0.4)
  Top 0.406: X5-JD.P$9 53.6,11.23 54.88,12.5 v54.88,23.5
  Bottom 0.406: v54.88,23.5 PCIE2.B2
M2_MCLK  (via drill 0.4)
  Top 0.3: v36.88,18.5 36.7,18.68 U1.7
  Bottom 0.406: PCIE2.A7 v36.88,18.5
M2_RST  (via drill 0.4)
  Top 0.406: v56.12,7 56.12,9.36 X5-JD.P$10
  Route15 0.406: v44.38,7.5 46.12,7.5 47.12,8.5 54.62,8.5 v56.12,7
  Bottom 0.406: PCIE2.A16 v44.38,7.5
M3_BOOT  (via drill 0.4)
  Top 0.406: X5-JB.P$9 8.11,7.48 6.88,6.25 6.88,4 9.62,1.25 90.62,1.25 92.38,3 v92.38,7.5
  Bottom 0.406: v92.38,7.5 PCIE3.B16
M3_CS  (via drill 0.4)
  Top 0.406: v78.88,11.75 78.88,14.61 X5-JE.P$4
  Bottom 0.3: PCIE3.A14 81.12,9.5 v78.88,11.75
M3_D0  (via drill 0.4)
  Top 0.406: X5-JE.P$1 71.28,20.4 v72.38,21.5
  Bottom 0.406: v72.38,21.5 PCIE3.A4
M3_D1  (via drill 0.4)
  Top 0.406: X5-JE.P$7 71.28,11.4 72.62,12.75 72.62,20.25 77.62,25.25 82.12,25.25 85.88,21.5 v88.38,21.5
  Bottom 0.406: v88.38,21.5 PCIE3.B4
M3_D2  (via drill 0.4)
  Top 0.406: X5-JE.P$2 73.81,20.19 v76.12,22.5
  Bottom 0.406: v76.12,22.5 PCIE3.A3
M3_D3  (via drill 0.4)
  Top 0.406: X5-JE.P$8 73.81,11.19 75.12,12.5 75.12,20 79.38,24.25 81.88,24.25 v84.62,21.5
  Bottom 0.406: v84.62,21.5 85.62,22.5 PCIE3.B3
M3_D4  (via drill 0.4)
  Top 0.406: X5-JE.P$3 76.36,19.73 v80.12,23.5
  Bottom 0.406: v80.12,23.5 PCIE3.A2
M3_D5  (via drill 0.4)
  Top 0.406: X5-JE.P$9 76.36,11.23 77.62,12.5 77.62,17 78.38,17.75 85.88,17.75 87.62,19.5 89.38,19.5 90.12,20.25 90.12,21.75 v88.38,23.5
  Bottom 0.406: v88.38,23.5 PCIE3.B2
M3_MCLK  (via drill 0.4)
  Top 0.3: v40.62,19.5 37.8,22.32 U1.8
  Route15 0.406: v80.62,18.5 42.12,18.5 41.12,19.5 v40.62,19.5
  Bottom 0.406: PCIE3.A7 v80.62,18.5
M3_RST  (via drill 0.4)
  Top 0.406: v79.12,6.5 78.89,6.73 X5-JE.P$10
  Bottom 0.406: PCIE3.A16 80.12,7.5 v79.12,6.5
MCLK
  Top 0.3: U1.1 37.35,25.48 35.84,23.96 U2.3
MCLK_ZYBO
  Top 0.406: X5-JB.P$1 3.02,24.9 4.12,26 18.12,26 21.88,22.25 35.33,22.25 U1.5
MISO  (via drill 0.4)
  Top 0.406: X5-JF.P$3 65.88,23.86 v65.88,11.75
  Route15 0.406: v40.38,11.5 41.38,12.5 v45.62,12.5 | v80.12,9.5 87.38,9.5 v88.38,10.5
  Bottom 0.406: PCIE1.B13 39.38,10.5 v40.38,11.5 | 65.62,10.5 PCIE2.B13 47.12,10.5 46.38,11.25 46.38,11.75 v45.62,12.5 | 65.62,10.5 79.12,10.5 v80.12,9.5 | v88.38,10.5 PCIE3.B13 | v65.88,11.75 65.62,11.5 65.62,10.5
MOSI  (via drill 0.4)
  Top 0.406: X5-JF.P$2 68.38,23.82 v68.38,11.75
  Route15 0.406: v4.38,10.5 v44.38,10.5 67.88,10.5 | 67.88,10.5 v85.38,10.5 | v68.38,11.75 67.88,11.25 67.88,10.5
  Bottom 0.406: PCIE1.A13 v4.38,10.5 | v44.38,10.5 PCIE2.A13 | v85.38,10.5 PCIE3.A13
UART_MOD_RX  (via drill 0.4)
  Top 0.406: v46.38,5.5 46.38,5 46.88,4.5 65.88,4.5 | 65.88,4.5 78.12,4.5 v79.62,3 | X5-JF.P$10 64.62,27.86 64.62,7.5 65.88,6.25 65.88,4.5
  Route15 0.406: v4.38,8.5 v40.38,8.5
  Bottom 0.406: PCIE1.A15 v4.38,8.5 | v40.38,8.5 PCIE2.A15 44.62,8.5 46.38,6.75 v46.38,5.5 | v79.62,3 82.12,3 83.62,4.5 85.12,4.5 85.12,7.75 84.38,8.5 PCIE3.A15
UART_MOD_TX  (via drill 0.4)
  Top 0.406: X5-JF.P$9 67.12,27.89 v67.12,9.5
  Route15 0.406: v45.88,8.5 42.38,8.5 41.38,7.5 v40.38,7.5 | v80.12,8.5 v88.38,8.5
  Bottom 0.406: PCIE1.B15 38.38,8.5 39.38,7.5 v40.38,7.5 | v45.88,8.5 PCIE2.B15 66.88,8.5 | 66.88,8.5 v80.12,8.5 | v88.38,8.5 PCIE3.B15 | v67.12,9.5 66.88,9.25 66.88,8.5